# Altium schematic sheet PWR_MGMT.SchDoc
size C; SheetNumber: 2; SheetTotal: 8
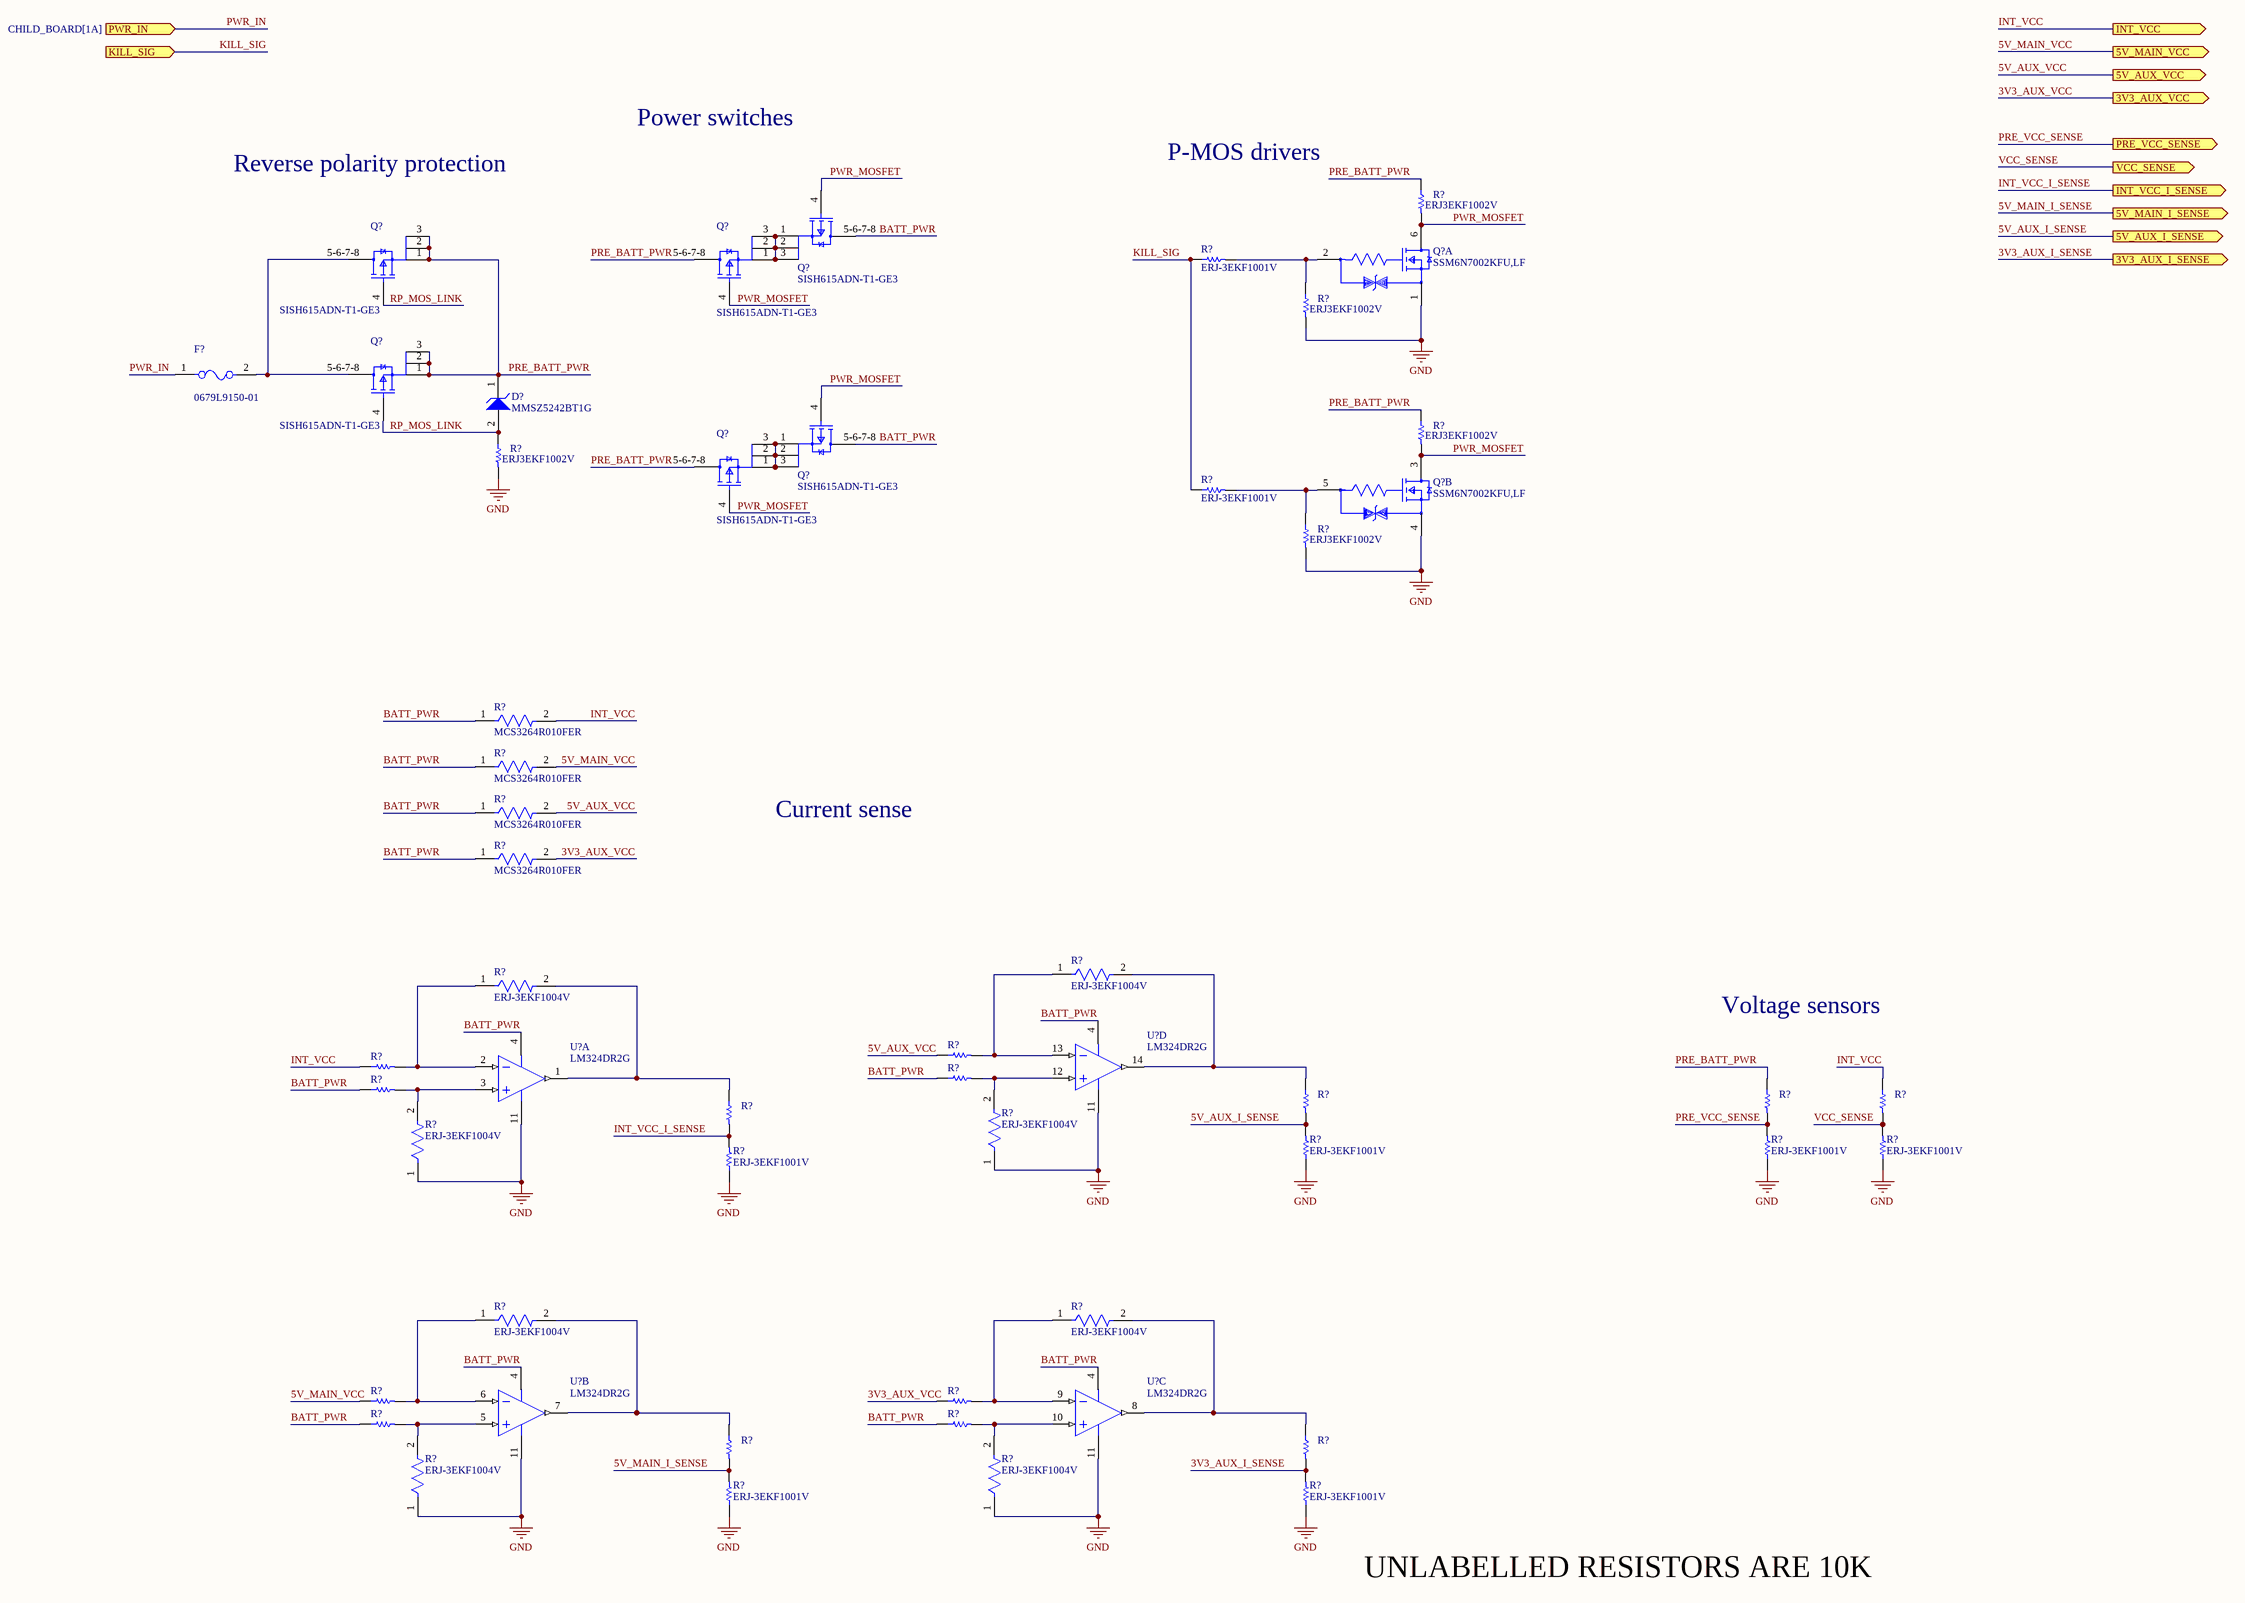
[diagram p0: PWR_MGMT.SchDoc]

## Parts
(Parts that share a designator on the sheet are numbered #1, #2 ... from top to bottom, then left to right.)
D?  MMSZ5242BT1G  [ONSC-SOD-123-2-425-04_V]
F?  0679L9150-01  [FP-0679L-MFG]
Q?#1  SISH615ADN-T1-GE3  [SISH615ADN-T1-GE3-Footprint-1]
Q?#2  SSM6N7002KFU,LF  [FP-SSOP6-P-0_65A-MFG]  (part A of 2)
Q?#3  SISH615ADN-T1-GE3  [SISH615ADN-T1-GE3-Footprint-1]
Q?#4  SISH615ADN-T1-GE3  [SISH615ADN-T1-GE3-Footprint-1]
Q?#5  SISH615ADN-T1-GE3  [SISH615ADN-T1-GE3-Footprint-1]
Q?#6  SISH615ADN-T1-GE3  [SISH615ADN-T1-GE3-Footprint-1]
Q?#7  SSM6N7002KFU,LF  [FP-SSOP6-P-0_65A-MFG]  (part B of 2)
Q?#8  SISH615ADN-T1-GE3  [SISH615ADN-T1-GE3-Footprint-1]
R?#1  ERJ3EKF1002V  [RESC1609X55X30LL15T15]
R?#2  ERJ-3EKF1001V  [RESC1608X55X30LL15T15]
R?#3  ERJ3EKF1002V  [RESC1609X55X30LL15T15]
R?#4  ERJ3EKF1002V  [RESC1609X55X30LL15T15]
R?#5  ERJ3EKF1002V  [RESC1609X55X30LL15T15]
R?#6  ERJ-3EKF1001V  [RESC1608X55X30LL15T15]
R?#7  ERJ3EKF1002V  [RESC1609X55X30LL15T15]
R?#8  MCS3264R010FER  [FP-MCS3264-MFG]
R?#9  MCS3264R010FER  [FP-MCS3264-MFG]
R?#10  MCS3264R010FER  [FP-MCS3264-MFG]
R?#11  MCS3264R010FER  [FP-MCS3264-MFG]
R?#12  ERJ-3EKF1004V  [FP-ERJ3EK-IPC_C]
R?#13  ERJ-3EKF1004V  [FP-ERJ3EK-IPC_C]
R?#14  ERJ3EKF1002V  [RESC1609X55X30LL15T15]  (value not drawn)
R?#15  ERJ3EKF1002V  [RESC1609X55X30LL15T15]  (value not drawn)
R?#16  ERJ3EKF1002V  [RESC1609X55X30LL15T15]  (value not drawn)
R?#17  ERJ3EKF1002V  [RESC1609X55X30LL15T15]  (value not drawn)
R?#18  ERJ3EKF1002V  [RESC1609X55X30LL15T15]  (value not drawn)
R?#19  ERJ3EKF1002V  [RESC1609X55X30LL15T15]  (value not drawn)
R?#20  ERJ3EKF1002V  [RESC1609X55X30LL15T15]  (value not drawn)
R?#21  ERJ3EKF1002V  [RESC1609X55X30LL15T15]  (value not drawn)
R?#22  ERJ-3EKF1001V  [RESC1608X55X30LL15T15]
R?#23  ERJ-3EKF1001V  [RESC1608X55X30LL15T15]
R?#24  ERJ-3EKF1001V  [RESC1608X55X30LL15T15]
R?#25  ERJ-3EKF1001V  [RESC1608X55X30LL15T15]
R?#26  ERJ-3EKF1004V  [FP-ERJ3EK-IPC_C]
R?#27  ERJ-3EKF1004V  [FP-ERJ3EK-IPC_C]
R?#28  ERJ-3EKF1004V  [FP-ERJ3EK-IPC_C]
R?#29  ERJ-3EKF1004V  [FP-ERJ3EK-IPC_C]
R?#30  ERJ3EKF1002V  [RESC1609X55X30LL15T15]  (value not drawn)
R?#31  ERJ3EKF1002V  [RESC1609X55X30LL15T15]  (value not drawn)
R?#32  ERJ3EKF1002V  [RESC1609X55X30LL15T15]  (value not drawn)
R?#33  ERJ3EKF1002V  [RESC1609X55X30LL15T15]  (value not drawn)
R?#34  ERJ3EKF1002V  [RESC1609X55X30LL15T15]  (value not drawn)
R?#35  ERJ3EKF1002V  [RESC1609X55X30LL15T15]  (value not drawn)
R?#36  ERJ-3EKF1001V  [RESC1608X55X30LL15T15]
R?#37  ERJ-3EKF1001V  [RESC1608X55X30LL15T15]
R?#38  ERJ-3EKF1004V  [FP-ERJ3EK-IPC_C]
R?#39  ERJ-3EKF1004V  [FP-ERJ3EK-IPC_C]
U?#1  LM324DR2G  [ONSC-SOIC-14-751A-03_V]  (part D of 4)
U?#2  LM324DR2G  [ONSC-SOIC-14-751A-03_V]  (part A of 4)
U?#3  LM324DR2G  [ONSC-SOIC-14-751A-03_V]  (part B of 4)
U?#4  LM324DR2G  [ONSC-SOIC-14-751A-03_V]  (part C of 4)

## Ports
3V3_AUX_I_SENSE (out), 3V3_AUX_VCC (out), 5V_AUX_I_SENSE (out), 5V_AUX_VCC (out), 5V_MAIN_I_SENSE (out), 5V_MAIN_VCC (out), INT_VCC (out), INT_VCC_I_SENSE (out), KILL_SIG (in), PRE_VCC_SENSE (out), PWR_IN (in, see CHILD_BOARD[1A]), VCC_SENSE (out)

## Nets
GND: Q?#2.1(Source1) Q?#7.4(Source2) R?#3.2 R?#5.2 R?#7.2 R?#22.1 R?#23.1 R?#24.1 R?#25.1 R?#26.1 R?#27.1 R?#36.1 R?#37.1 R?#38.1 R?#39.1 U?#1.11(VEE/GND) U?#2.11(VEE/GND) U?#3.11(VEE/GND) U?#4.11(VEE/GND)
3V3_AUX_I_SENSE: R?#35.2 R?#37.2 ; port 3V3_AUX_I_SENSE
3V3_AUX_VCC: R?#11.2 R?#31.1 ; port 3V3_AUX_VCC
5V_AUX_I_SENSE: R?#18.2 R?#22.2 ; port 5V_AUX_I_SENSE
5V_AUX_VCC: R?#10.2 R?#14.1 ; port 5V_AUX_VCC
5V_MAIN_I_SENSE: R?#34.2 R?#36.2 ; port 5V_MAIN_I_SENSE
5V_MAIN_VCC: R?#9.2 R?#30.1 ; port 5V_MAIN_VCC
BATT_PWR: Q?#1.5-6-7-8(D) Q?#5.5-6-7-8(D) R?#8.1 R?#9.1 R?#10.1 R?#11.1 R?#16.1 R?#17.1 R?#32.1 R?#33.1 U?#1.4(VCC) U?#2.4(VCC) U?#3.4(VCC) U?#4.4(VCC)
INT_VCC: R?#8.2 R?#15.1 R?#20.1 ; port INT_VCC
INT_VCC_I_SENSE: R?#21.2 R?#25.2 ; port INT_VCC_I_SENSE
KILL_SIG: R?#2.1 R?#6.1 ; port KILL_SIG
PRE_BATT_PWR: D?.1(K) Q?#3.1(S) Q?#3.2(S) Q?#3.3(S) Q?#4.5-6-7-8(D) Q?#6.1(S) Q?#6.2(S) Q?#6.3(S) Q?#8.5-6-7-8(D) R?#1.1 R?#4.1 R?#19.1
PRE_VCC_SENSE: R?#19.2 R?#23.2 ; port PRE_VCC_SENSE
PWR_IN: F?.1 ; port PWR_IN
PWR_MOSFET: Q?#1.4(G) Q?#2.6(Drain1) Q?#4.4(G) Q?#5.4(G) Q?#7.3(Drain2) Q?#8.4(G) R?#1.2 R?#4.2
RP_MOS_LINK: D?.2(A) Q?#3.4(G) Q?#6.4(G) R?#5.1
VCC_SENSE: R?#20.2 R?#24.2 ; port VCC_SENSE
NetF?_2: F?.2 Q?#3.5-6-7-8(D) Q?#6.5-6-7-8(D)
NetQ?#1_1: Q?#1.1(S) Q?#1.2(S) Q?#1.3(S) Q?#4.1(S) Q?#4.2(S) Q?#4.3(S)
NetQ?#2_2: Q?#2.2(Gate1) R?#2.2 R?#3.1
NetQ?#5_1: Q?#5.1(S) Q?#5.2(S) Q?#5.3(S) Q?#8.1(S) Q?#8.2(S) Q?#8.3(S)
NetQ?#7_5: Q?#7.5(Gate2) R?#6.2 R?#7.1
NetR?#12_1: R?#12.1 R?#14.2 U?#1.13(IN4-)
NetR?#12_2: R?#12.2 R?#18.1 U?#1.14(OUT4)
NetR?#13_1: R?#13.1 R?#15.2 U?#2.2(IN1-)
NetR?#13_2: R?#13.2 R?#21.1 U?#2.1(OUT1)
NetR?#16_2: R?#16.2 R?#26.2 U?#1.12(IN4+)
NetR?#17_2: R?#17.2 R?#27.2 U?#2.3(IN1+)
NetR?#28_1: R?#28.1 R?#30.2 U?#3.6(IN2-)
NetR?#28_2: R?#28.2 R?#34.1 U?#3.7(OUT2)
NetR?#29_1: R?#29.1 R?#31.2 U?#4.9(IN3-)
NetR?#29_2: R?#29.2 R?#35.1 U?#4.8(OUT3)
NetR?#32_2: R?#32.2 R?#38.2 U?#3.5(IN2+)
NetR?#33_2: R?#33.2 R?#39.2 U?#4.10(IN3+)

## Notes on the sheet
- Power switches
- P-MOS drivers
- Reverse polarity protection
- Current sense
- Voltage sensors
- UNLABELLED RESISTORS ARE 10K

## Library data of the parts
D? = CMP-1060-00565-1: Zener Voltage Regulator, 500 mW, 2-Pin SOD-123, Pb-Free, Tape and Reel; Manufacturer: On Semiconductor; P Max (W): 0.5; VZ Typ (V): 12; PartNumber: MMSZ5242BT1G; PackageReference: SOD-123-2-425-04; ComponentLink3URL: http://www.onsemi.com/pub_link/Collateral/425-04.PDF; Mounting Technology: Surface Mount; ComponentLink2Description: Datasheet; ComponentLink1URL: http://www.onsemi.com/; ComponentLink3Description: Package Specification; PackageDescription: 2-Pin SOD, Body 1.6 x 2.69 mm; PackageVersion: Rev. G, 10/2009; ComponentLink1Description: Manufacturer URL; RoHS: Pb-Free; ComponentLink2URL: http://www.onsemi.com/pub_link/Collateral/MMSZ5221BT1-D.PDF; Packing: Tape and Reel; DatasheetVersion: Rev. 12
F? = CMP-16042-000002-1: FUSE BRD MNT 15A 125VAC/VDC; Manufacturer: Bel Fuse; Max Fuse Ac Voltage: 125V; Fuse Blow Speed: Fast; Fuse I2T: 103.5A2Sec; Fuse Interrupt Ac Current: 50A; Automotive Grade: Grade 1; Value: 0.0038Ω; Fuse Interrupt Dc Current: 300A; Fuse Voltage Drop: 0.13V; Device Class L2: Fuses; ComponentLink2URL: https://www.belfuse.com/resources/CircuitProtection/datasheets/0679L%20Sep2016.pdf; Package: 0679L; Height: 2.79mm; Digikey Description: FUSE BRD MNT 15A 125VAC/VDC; Temperature Range High: +125°C; Device Class L3: unset; Octopart: https://octopart.com/0679l9150-01-bel+fuse-70850665; Temperature Range Low: -55°C; Fuse Current: 15A; Max Fuse Dc Voltage: 125V; Ipc Land Pattern Name: CAPC610254X254; Manufacturer Part Number: 0679L9150-01; Category: Fuse; Lead Free: Yes; Automotive: Yes; Resistance: 0.0038Ω; RoHS: TRUE; Device Class L1: Circuit Protection; ComponentLink2Description: Datasheet; Temperature: -55°C to +125°C; Voltage Rating: 125V
Q?#1 Q?#3-Q?#6 Q?#8 = CMP-013-00036-2: Trans MOSFET P-CH 20V 22.1A 8-Pin PowerPAK 1212 EP T/R
Q?#2 Q?#7 = CMP-35916-000009-1: MOSFET 2N-CH 60V 0.3A; Input Capacitance: 40pF; Continuous Drain Current (ID): 300mA; Max Power Dissipation: 285mW; FET Type: 2 N-Channel; Rds On Max: 1.5R; Mount: Surface Mount; Drain to Source Voltage (Vdss): 60V; Packaging: Tape and Reel
R?#1 R?#3-R?#5 R?#7 R?#14-R?#21 R?#30-R?#35 = CMP-1012-00623-3: Chip Resistor, 10 KOhm, +/- 1%, 0.1 W, -55 to 155 degC, 0603 (1608 Metric), RoHS, Tape and Reel; Manufacturer: Panasonic; Voltage Rating: 75V; Case\/Package: 0603; Power Rating: 100mW; Resistance: 10KOhm; Temperature Coefficient: 100ppm\/degreesC; Number of Pins: 2; Package Reference: 603; Depth: 0.8mm; Mount: SurfaceMount; Package Description: 2-Pin Surface Mount Device, Body 1.6 x 0.85 mm; Datasheet Version: 02/2017; Length: 1.6mm; Lead Free: LeadFree; Height: 0.45mm; Number of Terminations: 2; Max Power Dissipation: 100mW; Min Operating Temperature: -55degC; Datasheet URL: https://industrial.panasonic.com/cdbs/www-data/pdf/RDA0000/AOA0000C304.pdf; Termination: SMD/SMT; Case Code (Metric): 1608; Case Code (Imperial): 0603; Tolerance: 1%; Max Operating Temperature: 155degC; RoHSCompliant: true; Voltage Rating (DC): 75V; Radiation Hardening: No; Packaging: TapeandReel; Composition: ThickFilm; Mounting Technology: SurfaceMount; Manufacturer URL: http://www.panasonic.com/; Width: 0.031inch; REACH SVHC: NoSVHC; Contact Plating: Tin; Military Standard: Not; Package Quantity: 1
R?#2 R?#6 R?#22-R?#25 R?#36 R?#37 = CMP-2000-00180-1: Manufacturer: Panasonic; Part Number: ERJ-3EKF1001V
R?#8-R?#11 = CMP-33361-000012-1: RES SMD 10 MOHM 1% 2W 3264; Temperature Coefficient: 50ppm/°C; Resistance: 10mR; Voltage Rating: 220mV; Case/Package: 2512; Military Standard: Not; Max Operating Temperature: 150°C; Height: 0.024inch; Package Quantity: 1; Case Code (Imperial): 2512; Number of Terminations: 2; Features: Flame Retardant Coating; Width: 0.126inch; Tolerance: 1%; Composition: Metal Element; Number of Pins: 2; Packaging: Tape and Reel; Depth: 3.2mm; Termination: SMD/SMT; Min Operating Temperature: -55°C; Power Rating: 2W; Case Code (Metric): 6432; Max Power Dissipation: 2W; Mount: Surface Mount; Length: 6.4mm
R?#12 R?#13 R?#26-R?#29 R?#38 R?#39 = CMP-1012-00849-3: RES SMD 1M OHM 1% 1/10W 0603; Resistance: 1MR; Voltage Rating: 75V; Temperature Coefficient: 100ppm/°C; Power Rating: 100mW; REACH SVHC: No SVHC; Radiation Hardening: No; Features: Automotive AEC-Q200; Case Code (Metric): 1608; Resistance Tolerance: 1%; Case/Package: 0603; Termination: SMD/SMT; Max Operating Temperature: 155°C; Tolerance: 1%; Size Code: 0603; Case Code (Imperial): 0603; Min Operating Temperature: -55°C; Number of Pins: 2; Mount: Surface Mount; Package Quantity: 1; Military Standard: Not; Voltage Rating (DC): 75V; Depth: 0.8mm; Packaging: Tape and Reel; Width: 0.8mm; Number of Terminations: 2; Length: 1.6mm; Height: 0.022inch; RoHS Compliant: Yes; Resistor Type: Thick Film; Contact Plating: Tin; Lead Free: Lead Free; Series: ERJ; Construction: Rectangular; Max Power Dissipation: 100mW
U?#1-U?#4 = CMP-1310-00171-1: Single Supply Quad Operational Amplifier, 3 to 32 V, 0 to 70 degC, 14-Pin SOIC, Pb-Free, Tape and Reel; Manufacturer: On Semiconductor; VCC Max (V): 32; VCC Min (V): 3; PackageVersion: Rev. K, 05/2011; ComponentLink3URL: http://www.onsemi.com/pub_link/Collateral/751A-03.PDF; ComponentLink3Description: Package Specification; Packing: Tape and Reel; ComponentLink2URL: http://www.onsemi.cn/pub_link/Collateral/LM324-D.PDF; PackageReference: SOIC-14-751A-03; ComponentLink1URL: http://www.onsemi.com/; PackageDescription: 14-Pin Small Outline Integrated Circuit, Body 8.65 x 3.9 mm, Pitch 1.27 mm; ComponentLink1Description: Manufacturer URL; DatasheetVersion: Rev. 25; Mounting Technology: Surface Mount; RoHS: TRUE; ComponentLink2Description: Datasheet; PartNumber: LM324DR2G